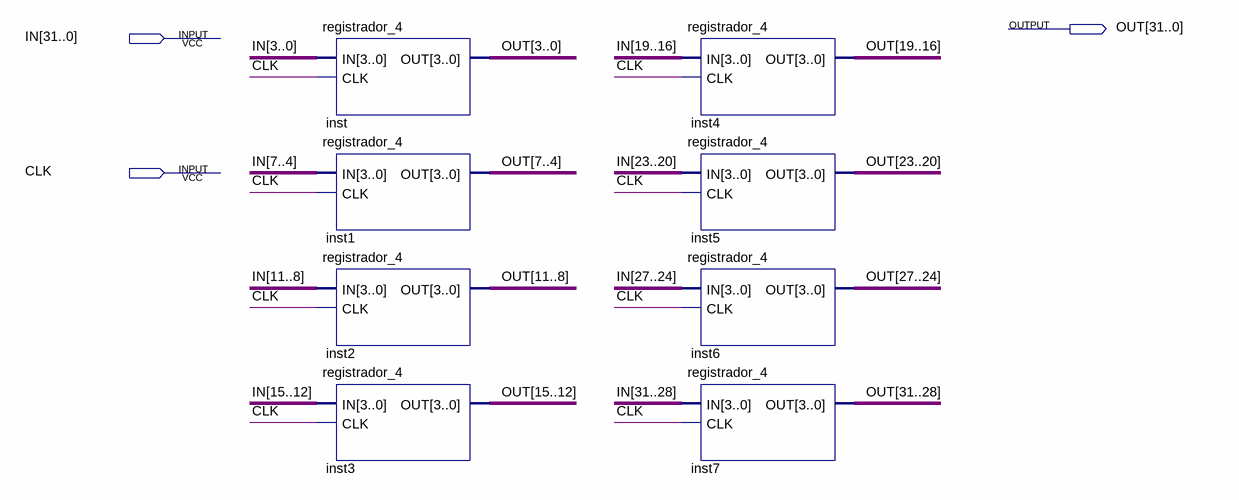
[diagram p0: schematic sheet]
// Quartus schematic registrador_32_.bdf as structural Verilog: 8 symbols, 3 pins
module registrador_32_ (
  input  [31:0] IN,
  input  CLK,
  output [31:0] OUT
);

  registrador_4 inst (.IN(IN[3:0]), .CLK(CLK), .OUT(OUT[3:0]));
  registrador_4 inst1 (.IN(IN[7:4]), .CLK(CLK), .OUT(OUT[7:4]));
  registrador_4 inst2 (.IN(IN[11:8]), .CLK(CLK), .OUT(OUT[11:8]));
  registrador_4 inst3 (.IN(IN[15:12]), .CLK(CLK), .OUT(OUT[15:12]));
  registrador_4 inst4 (.IN(IN[19:16]), .CLK(CLK), .OUT(OUT[19:16]));
  registrador_4 inst5 (.IN(IN[23:20]), .CLK(CLK), .OUT(OUT[23:20]));
  registrador_4 inst6 (.IN(IN[27:24]), .CLK(CLK), .OUT(OUT[27:24]));
  registrador_4 inst7 (.IN(IN[31:28]), .CLK(CLK), .OUT(OUT[31:28]));
endmodule
